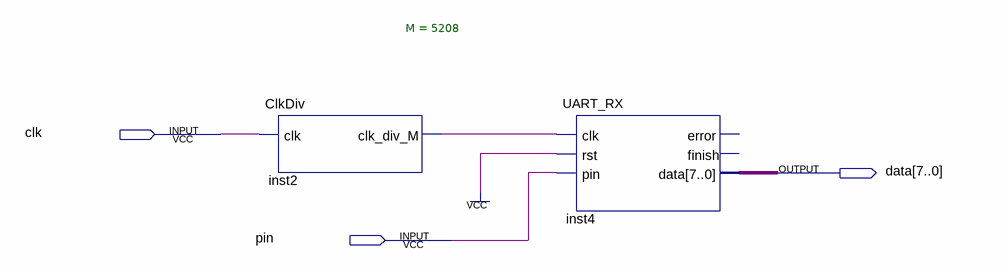
[diagram p0: schematic sheet]
// Quartus schematic EnvTest.bdf as structural Verilog: 2 symbols, 3 pins
module EnvTest (
  input  clk,
  input  pin,
  output [7:0] data
);

  wire inst2_clk_div_m;

  ClkDiv #(.M(5208)) inst2 (.clk(clk), .clk_div_M(inst2_clk_div_m));
  UART_RX inst4 (.clk(inst2_clk_div_m), .rst(1'b1), .pin(pin), .data(data));  // open: error, finish
endmodule
